# Altium schematic sheet Battery Bus Interface REVB.SchDoc: Schematic
size B; DrawnBy: DJW; SheetNumber: 1; SheetTotal: 2
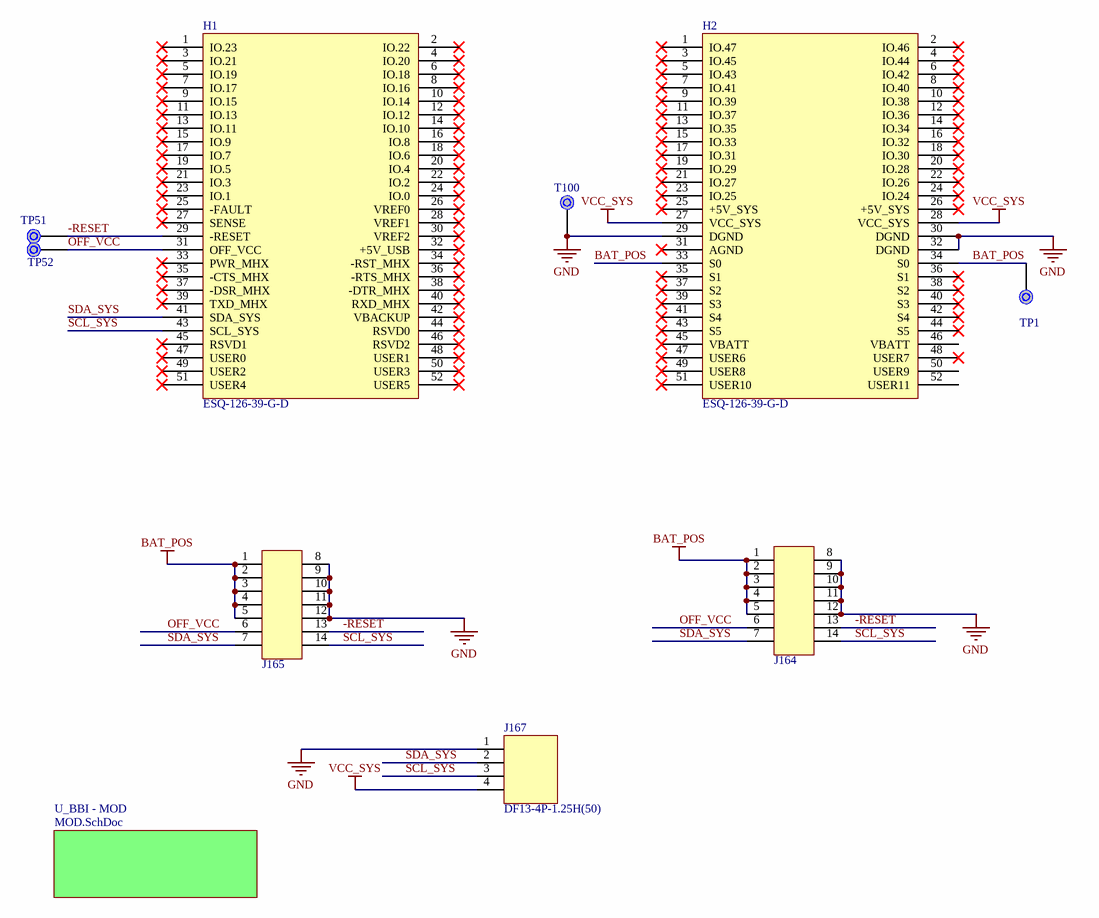
[diagram p0: Battery Bus Interface REVB.SchDoc]

## Parts
H1  ESQ-126-39-G-D  [ESQ-126-39-G-D]
H2  ESQ-126-39-G-D  [ESQ-126-39-G-D]
J164  M80-5401442  [M80-5401442]  (value not drawn)
J165  M80-5401442  [M80-5401442]  (value not drawn)
J167  DF13-4P-1.25H(50)  [DF13A_4P]
T100  GND Testpoint  [GND Testpoint]  (value not drawn)  (no BOM)
TP1  Testpoint  [Testpoint]  (value not drawn)  (no BOM)
TP51  Testpoint  [Testpoint]  (value not drawn)  (no BOM)
TP52  Testpoint  [Testpoint]  (value not drawn)  (no BOM)

## Sub-sheets
U_BBI - MOD = MOD.SchDoc: no entries

## Nets
BAT_POS: H2.33(S0) H2.34(S0) J164.1 J164.2 J164.3 J164.4 J164.5 J165.1 J165.2 J165.3 J165.4 J165.5 TP1.1
GND: H2.29(DGND) H2.30(DGND) H2.32(DGND) J164.8 J164.9 J164.10 J164.11 J164.12 J164.MNT J165.8 J165.9 J165.10 J165.11 J165.12 J165.MNT J167.1 J167.F T100.1
VCC_SYS: H2.27(VCC_SYS) H2.28(VCC_SYS) J167.4
-RESET: H1.29(-RESET) J164.13 J165.13 TP51.1
OFF_VCC: H1.31(OFF_VCC) J164.6 J165.6 TP52.1
SCL_SYS: H1.43(SCL_SYS) J164.14 J165.14 J167.3
SDA_SYS: H1.41(SDA_SYS) J164.7 J165.7 J167.2

Not connected (* = marked no-connect by the designer): H1 1(IO.23)* 2(IO.22)* 3(IO.21)* 4(IO.20)* 5(IO.19)* 6(IO.18)* 7(IO.17)* 8(IO.16)* 9(IO.15)* 10(IO.14)* 11(IO.13)* 12(IO.12)* 13(IO.11)* 14(IO.10)* 15(IO.9)* 16(IO.8)* 17(IO.7)* 18(IO.6)* 19(IO.5)* 20(IO.4)* 21(IO.3)* 22(IO.2)* 23(IO.1)* 24(IO.0)* 25(-FAULT)* 26(VREF0)* 27(SENSE)* 28(VREF1)* 30(VREF2)* 32(+5V_USB)* 33(PWR_MHX)* 34(-RST_MHX)* 35(-CTS_MHX)* 36(-RTS_MHX)* 37(-DSR_MHX)* 38(-DTR_MHX)* 39(TXD_MHX)* 40(RXD_MHX)* 42(VBACKUP)* 44(RSVD0)* 45(RSVD1)* 46(RSVD2)* 47(USER0)* 48(USER1)* 49(USER2)* 50(USER3)* 51(USER4)* 52(USER5)*; H2 1(IO.47)* 2(IO.46)* 3(IO.45)* 4(IO.44)* 5(IO.43)* 6(IO.42)* 7(IO.41)* 8(IO.40)* 9(IO.39)* 10(IO.38)* 11(IO.37)* 12(IO.36)* 13(IO.35)* 14(IO.34)* 15(IO.33)* 16(IO.32)* 17(IO.31)* 18(IO.30)* 19(IO.29)* 20(IO.28)* 21(IO.27)* 22(IO.26)* 23(IO.25)* 24(IO.24)* 25(+5V_SYS)* 26(+5V_SYS)* 31(AGND)* 35(S1)* 36(S1)* 37(S2)* 38(S2)* 39(S3)* 40(S3)* 41(S4)* 42(S4)* 43(S5)* 44(S5)* 45(VBATT)* 46(VBATT) 47(USER6)* 48(USER7)* 49(USER8)* 50(USER9) 51(USER10)* 52(USER11)

## Notes on the sheet
- Title:
- 750 Naples Street
- San Francisco, California  94112
- Doc. Rev: 01
- File:
- Part Number:
- Revision:
- Sheet:
- (C) 2001-2018 Pumpkin, Inc.
- Date:
- Size:
- B
- Drawn By:

## Library data of the parts
H1 = CubesatBus-H1 ESQ-126-39-G-D: Header PC/104 52-pin; Supplier 1: Digi-Key; Supplier Part Number 1: SAM10462-ND
H2 = CubesatBus-H2 ESQ-126-39-G-D: Header PC/104 52-pin; Supplier 1: Digi-Key; Supplier Part Number 1: SAM10462-ND
J164 J165 = M80-5401442: Header M80 14POS RA; Manufacturer: Harwin; Value: 14 Power Pins; Manufacturer Part Number: M80-5401442; Supplier 1: Digi-Key; Supplier Part Number 1: 952-1026-5-ND; Package / Case: THT, RA; Operating Temperature: -55°C ~ 85°C
J167 = DF13-4P-1.25H(50): Header DF13-RA 4-Pin; Supplier 1: Digi-Key; Supplier Part Number 1: H3352-ND
T100 = GND Testpoint: Testpoint GND